# Altium schematic sheet HallSensor.SchDoc
size A4; Organization: Altium Limited; Address1: L3, 12a Rodborough Rd; Address2: Frenchs Forest; Address3: NSW; Address4: Australia 2086
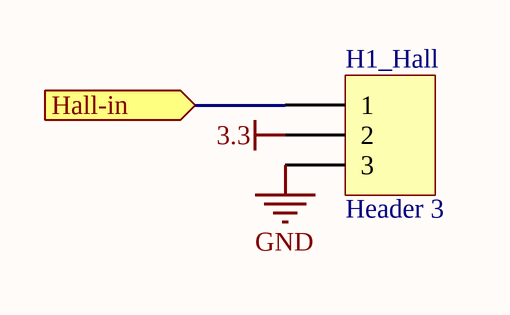
[diagram p0: HallSensor.SchDoc]

## Parts
H1_Hall  Header 3  [HDR1X3]

## Ports
Hall-in

## Nets
3.3: H1_Hall.2
GND: H1_Hall.3
Hall-in: H1_Hall.1 ; port Hall-in

## Notes on the sheet
- Title
- Size:
- Date:
- A4
- Number:
- Time:
- Revision:
- Sheet
- of
- File:

## Library data of the parts
H1_Hall = Header 3: Header, 3-Pin; LatestRevisionDate: 17-Jul-2002; LatestRevisionNote: Re-released for DXP Platform.; Publisher: Altium Limited